# Altium schematic sheet 编码器.SchDoc
size A3; SheetNumber: 1; SheetTotal: 1
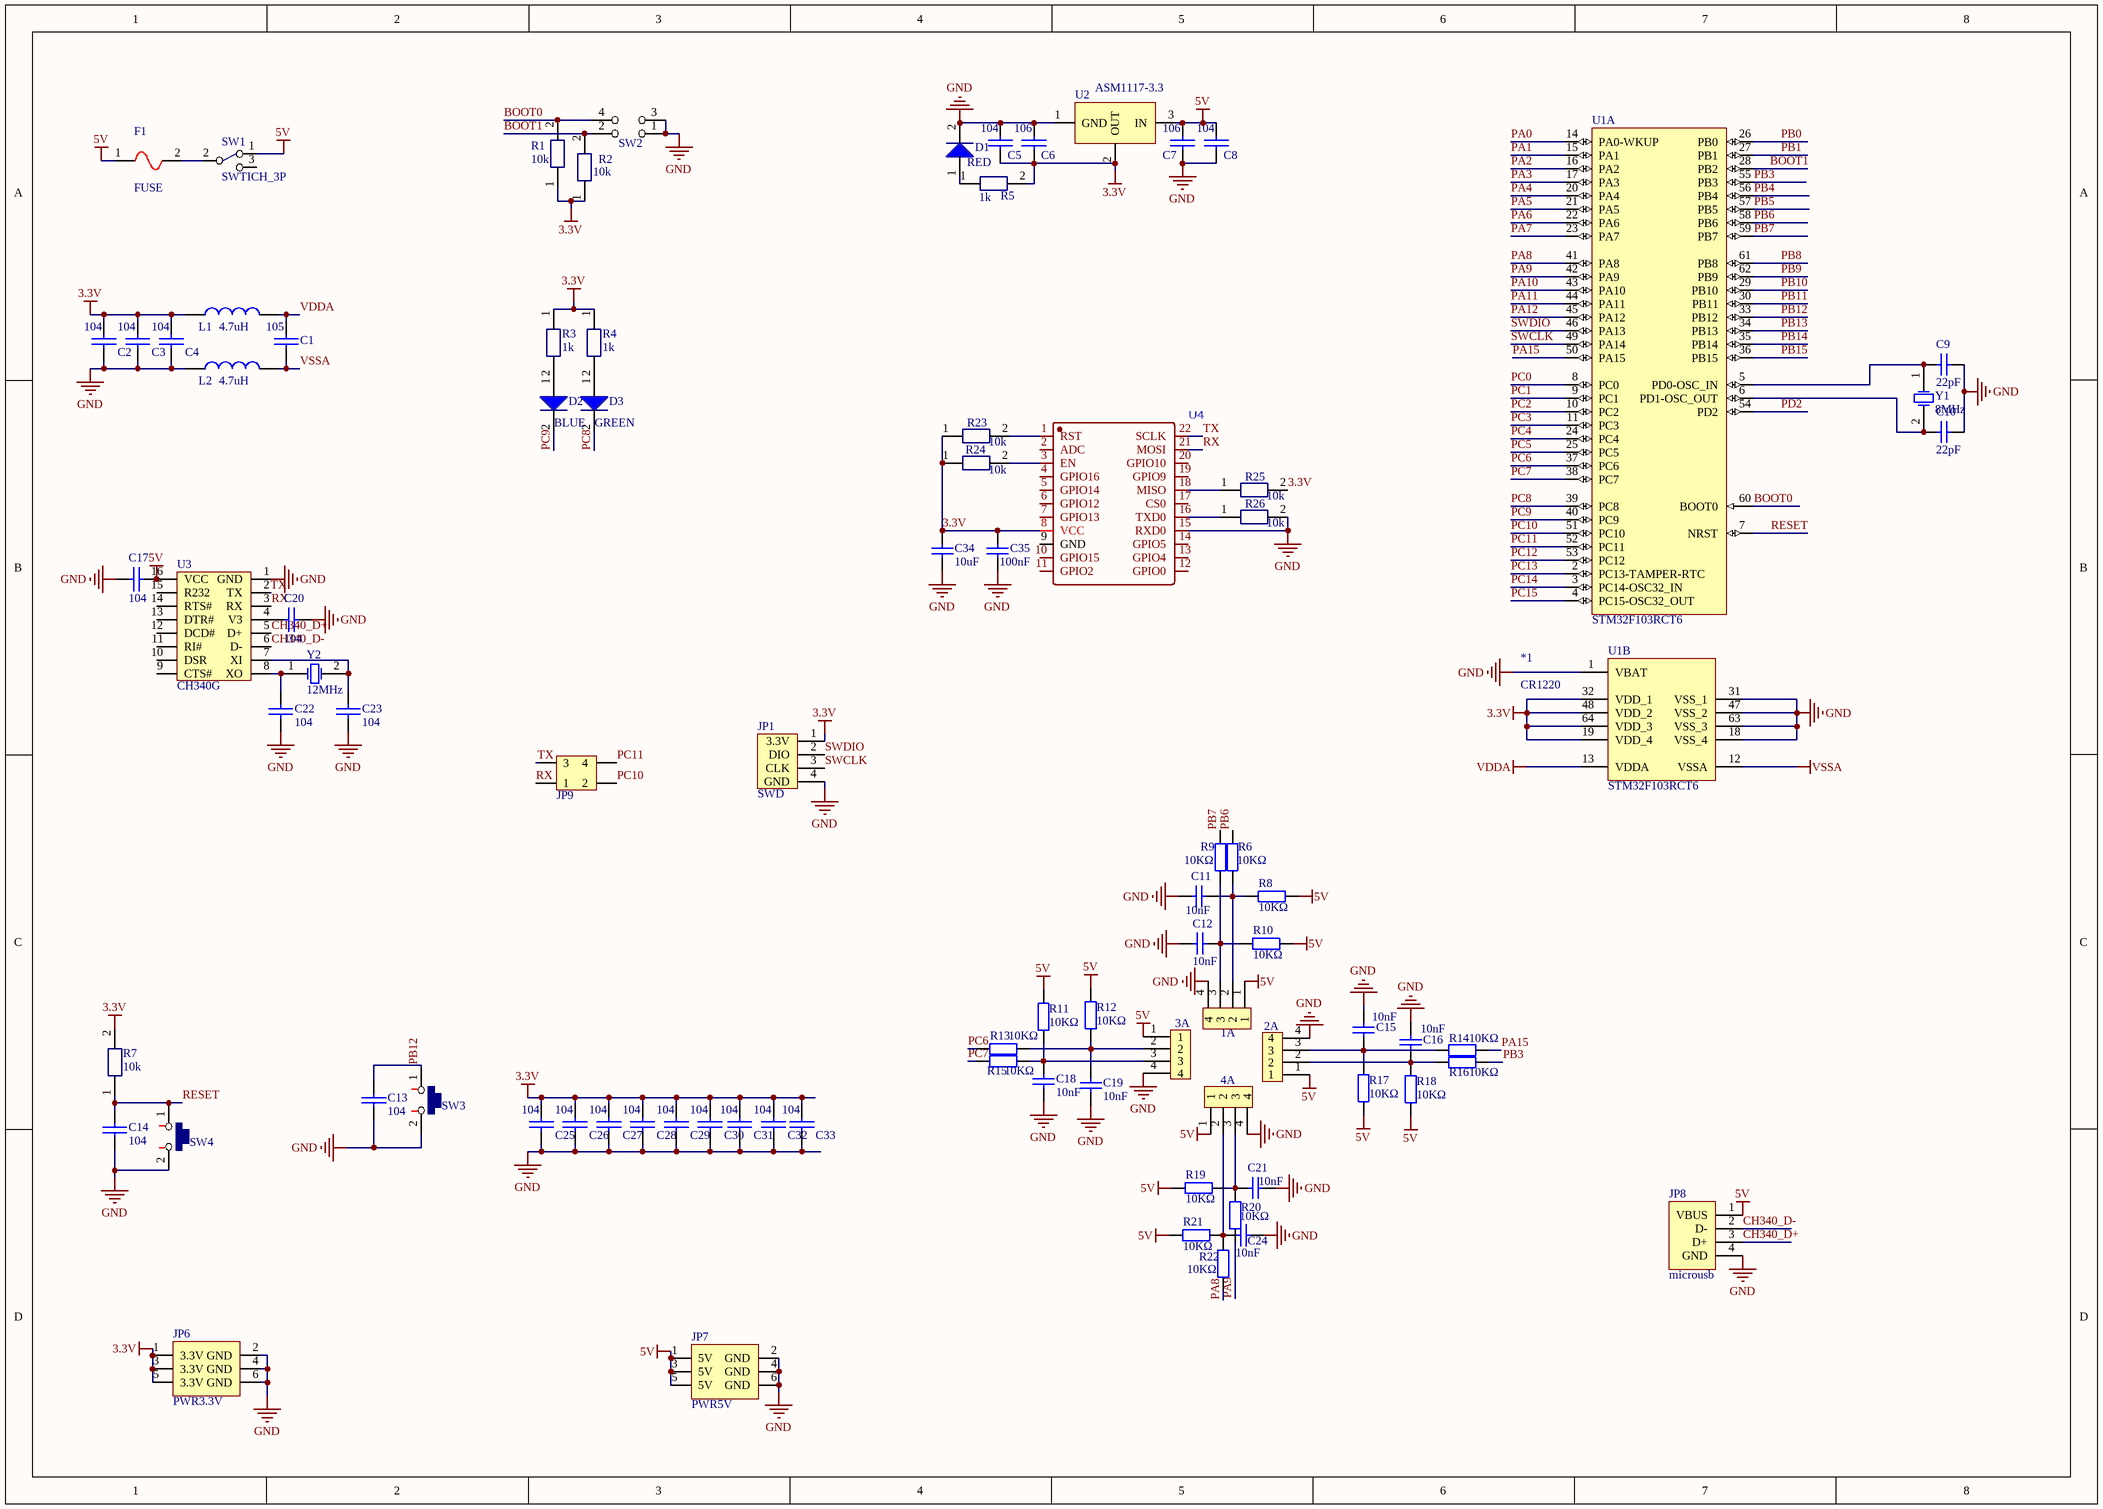
[diagram p0: 编码器.SchDoc]

## Parts
1  PIN4  (value not drawn)  (part A of 2)
2  PIN4  (value not drawn)  (part A of 2)
3  PIN4  (value not drawn)  (part A of 2)
4  PIN4  (value not drawn)  (part A of 2)
*1  CR1220
C1  0805c  [0805C]  (value not drawn)
C2  0805c  [0805C]  (value not drawn)
C3  0805c  [0805C]  (value not drawn)
C4  0805c  [0805C]  (value not drawn)
C5  0805c  [0805C]  (value not drawn)
C6  0805c  [0805C]  (value not drawn)
C7  0805c  [0805C]  (value not drawn)
C8  0805c  [0805C]  (value not drawn)
C9  22pF  [0805C]
C10  22pF  [0805C]
C11  10nF  [0805C]
C12  10nF  [0805C]
C13  0805c  [0805C]  (value not drawn)
C14  0805c  [0805C]  (value not drawn)
C15  10nF  [0805C]
C16  10nF  [0805C]
C17  0805c  [0805C]  (value not drawn)
C18  10nF  [0805C]
C19  10nF  [0805C]
C20  0805c  [0805C]  (value not drawn)
C21  10nF  [0805C]
C22  0805c  [0805C]  (value not drawn)
C23  0805c  [0805C]  (value not drawn)
C24  10nF  [0805C]
C25  0805c  [0805C]  (value not drawn)
C26  0805c  [0805C]  (value not drawn)
C27  0805c  [0805C]  (value not drawn)
C28  0805c  [0805C]  (value not drawn)
C29  0805c  [0805C]  (value not drawn)
C30  0805c  [0805C]  (value not drawn)
C31  0805c  [0805C]  (value not drawn)
C32  0805c  [0805C]  (value not drawn)
C33  0805c  [0805C]  (value not drawn)
C34  10uF  [0805C]
C35  100nF  [0805C]
D1  LED  [0805D]  (value not drawn)
D2  LED  [0805D]  (value not drawn)
D3  LED  [0805D]  (value not drawn)
F1  FUSE  [1206R]
JP1  SWD  [SWD]
JP2  PIN4  [HDR1X4]  (value not drawn)  (part B of 2)
JP3  PIN4  [HDR1X4]  (value not drawn)  (part B of 2)
JP4  PIN4  [HDR1X4]  (value not drawn)  (part B of 2)
JP5  PIN4  [HDR1X4]  (value not drawn)  (part B of 2)
JP6  PWR3.3V  [PWR]
JP7  PWR5V  [PWR]
JP8  microusb  [MICRO-USB-SMD_MICROXNJ]
JP9  2*2  [CON20VP2R54-2X2TM]  (value not drawn)
L1  0805L  [0805L]  (value not drawn)
L2  0805L  [0805L]  (value not drawn)
R1  0805r  [0805R]  (value not drawn)
R2  0805r  [0805R]  (value not drawn)
R3  0805r  [0805R]  (value not drawn)
R4  0805r  [0805R]  (value not drawn)
R5  0805r  [0805R]  (value not drawn)
R6  10KΩ  [0805R]
R7  0805r  [0805R]  (value not drawn)
R8  10KΩ  [0805R]
R9  10KΩ  [0805R]
R10  10KΩ  [0805R]
R11  10KΩ  [0805R]
R12  10KΩ  [0805R]
R13  10KΩ  [0805R]
R14  10KΩ  [0805R]
R15  10KΩ  [0805R]
R16  10KΩ  [0805R]
R17  10KΩ  [0805R]
R18  10KΩ  [0805R]
R19  10KΩ  [0805R]
R20  10KΩ  [0805R]
R21  10KΩ  [0805R]
R22  10KΩ  [0805R]
R23  0805r  [0805R]  (value not drawn)
R24  0805r  [0805R]  (value not drawn)
R25  0805r  [0805R]  (value not drawn)
R26  0805r  [0805R]  (value not drawn)
SW1  SWTICH_3P  [SWITCH_3P]
SW2  SW_BOOT  [CON20VP2R54-2X2TM]  (value not drawn)
SW3  KEY  [SW-SMD_L6.1-W3.6-LS8.0]  (value not drawn)
SW4  KEY  [SW-SMD_L6.1-W3.6-LS8.0]  (value not drawn)
U1  STM32F103RCT6  [PCBComponent_1]  (parts A,B of 2)
U2  ASM1117-3.3  [SOT223_N]
U3  CH340G  [SOP16]
U4  (no value)  [WIFIM-SMD_ESP-12F-ESP8266MOD]
Y1  8MHz  [HC-49US_L11.5-W4.5-P4.88]
Y2  12MHz  [HC-49US_L11.5-W4.5-P4.88]

## Nets
3.3V: C2.1 C3.1 C4.1 C5.2 C6.2 C25.1 C26.1 C27.1 C28.1 C29.1 C30.1 C31.1 C32.1 C33.1 C34.2 C35.2 JP1.1(3.3V) JP6.1(3.3V) JP6.3(3.3V) JP6.5(3.3V) L1.1 R1.1 R2.1 R3.1 R4.1 R5.2 R7.2 R23.1 R24.1 R25.2 U1.19(VDD_4) U1.32(VDD_1) U1.48(VDD_2) U1.64(VDD_3) U2.2(OUT) U4.8(VCC)
5V: C7.1 C8.1 C17.2 F1.1 JP2.1 JP3.1 JP4.1 JP5.1 JP7.1(5V) JP7.3(5V) JP7.5(5V) JP8.1(VBUS) R8.1 R10.1 R11.1 R12.2 R17.2 R18.1 R19.1 R21.1 SW1.1 U2.3(IN) U3.16(VCC)
GND: C2.2 C3.2 C4.2 C5.1 C6.1 C7.2 C8.2 C9.2 C10.2 C11.1 C12.1 C13.2 C14.2 C15.1 C16.2 C17.1 C18.2 C19.2 C20.2 C21.2 C22.2 C23.2 C24.2 C25.2 C26.2 C27.2 C28.2 C29.2 C30.2 C31.2 C32.2 C33.2 C34.1 C35.1 D1.2 JP1.4(GND) JP2.4 JP3.4 JP4.4 JP5.4 JP6.2(GND) JP6.4(GND) JP6.6(GND) JP7.2(GND) JP7.4(GND) JP7.6(GND) JP8.4(GND) L2.1 R26.2 SW2.1 SW2.3 SW3.2 SW4.2 U1.1(VBAT) U1.18(VSS_4) U1.31(VSS_1) U1.47(VSS_2) U1.63(VSS_3) U2.1(GND) U3.1(GND) U4.15(RXD0)
VDDA: C1.1 L1.2 U1.13(VDDA)
VSSA: C1.2 L2.2 U1.12(VSSA)
BOOT0: R1.2 SW2.4 U1.60(BOOT0)
BOOT1: R2.2 SW2.2 U1.28(PB2)
CH340_D+: JP8.3(D+) U3.5(D+)
CH340_D-: JP8.2(D-) U3.6(D-)
PA0: U1.14(PA0-WKUP)
PA1: U1.15(PA1)
PA2: U1.16(PA2)
PA3: U1.17(PA3)
PA4: U1.20(PA4)
PA5: U1.21(PA5)
PA6: U1.22(PA6)
PA7: U1.23(PA7)
PA8: R22.2 U1.41(PA8)
PA9: R20.2 U1.42(PA9)
PA10: U1.43(PA10)
PA11: U1.44(PA11)
PA12: U1.45(PA12)
PA15: R14.2 U1.50(PA15)
PB0: U1.26(PB0)
PB1: U1.27(PB1)
PB3: R16.2 U1.55(PB3)
PB4: U1.56(PB4)
PB5: U1.57(PB5)
PB6: R6.2 U1.58(PB6)
PB7: R9.2 U1.59(PB7)
PB8: U1.61(PB8)
PB9: U1.62(PB9)
PB10: U1.29(PB10)
PB11: U1.30(PB11)
PB12: C13.1 SW3.1 U1.33(PB12)
PB13: U1.34(PB13)
PB14: U1.35(PB14)
PB15: U1.36(PB15)
PC0: U1.8(PC0)
PC1: U1.9(PC1)
PC2: U1.10(PC2)
PC3: U1.11(PC3)
PC4: U1.24(PC4)
PC5: U1.25(PC5)
PC6: R13.1 U1.37(PC6)
PC7: R15.1 U1.38(PC7)
PC8: D3.2 U1.39(PC8)
PC9: D2.2 U1.40(PC9)
PC10: JP9.2 U1.51(PC10)
PC11: JP9.4 U1.52(PC11)
PC12: U1.53(PC12)
PC13: U1.2(PC13-TAMPER-RTC)
PC14: U1.3(PC14-OSC32_IN)
PC15: U1.4(PC15-OSC32_OUT)
PD2: U1.54(PD2)
RESET: C14.1 R7.1 SW4.1 U1.7(NRST)
RX: JP9.1 U3.3(RX) U4.21(MOSI)
SWCLK: JP1.3(CLK) U1.49(PA14)
SWDIO: JP1.2(DIO) U1.46(PA13)
TX: JP9.3 U3.2(TX) U4.22(SCLK)
NetC9_1: C9.1 U1.5(PD0-OSC_IN) Y1.1(OSC1)
NetC10_1: C10.1 U1.6(PD1-OSC_OUT) Y1.2(OSC2)
NetC11_2: C11.2 JP4.2 R6.1 R8.2
NetC12_2: C12.2 JP4.3 R9.1 R10.2
NetC15_2: C15.2 JP2.3 R14.1 R17.1
NetC16_1: C16.1 JP2.2 R16.1 R18.2
NetC18_1: C18.1 JP3.3 R11.2 R15.2
NetC19_1: C19.1 JP3.2 R12.1 R13.2
NetC20_1: C20.1 U3.4(V3)
NetC21_1: C21.1 JP5.3 R19.2 R20.1
NetC22_1: C22.1 U3.8(XO) Y2.1(OSC1)
NetC23_1: C23.1 U3.7(XI) Y2.2(OSC2)
NetC24_1: C24.1 JP5.2 R21.2 R22.1
NetD1_1: D1.1 R5.1
NetD2_1: D2.1 R3.2
NetD3_1: D3.1 R4.2
NetF1_2: F1.2 SW1.2
NetR23_2: R23.2 U4.1(RST)
NetR24_2: R24.2 U4.3(EN)
NetR25_1: R25.1 U4.18(MISO)
NetR26_1: R26.1 U4.16(TXD0)

Not connected (* = marked no-connect by the designer): SW1 3; U3 9(CTS#) 10(DSR) 11(RI#) 12(DCD#) 13(DTR#) 14(RTS#) 15(R232); U4 2(ADC) 4(GPIO16) 5(GPIO14) 6(GPIO12) 7(GPIO13) 9(GND) 10(GPIO15) 11(GPIO2) 12(GPIO0) 13(GPIO4) 14(GPIO5) 17(CS0) 19(GPIO9) 20(GPIO10)

## Notes on the sheet
- (in symbol 0805c) 104; 105; 106
- (in symbol 0805L) 4.7uH
- (in symbol 0805r) 10k; 1k
- (in symbol LED) RED; BLUE; GREEN

## Library data of the parts
C9 C10 = 0805 22pF (220) 5% 50V: 贴片电容; ComponentLink1Description: 供应商链接; ComponentLink1URL: http://www.szlcsc.com/product/details_2156.html; Package: 0805; Supplier: LC; SuppliersPartNumber: C1804
C11 C12 C15 C16 C18 C19 C21 C24 = 0805 10nF (103) 10% 50V: 贴片电容; ComponentLink1Description: 供应商链接; ComponentLink1URL: http://www.szlcsc.com/product/details_2062.html; Package: 0805; Supplier: LC; SuppliersPartNumber: C1710
C34 = 0805 10uF (106) 10% 25V: 贴片电容; ComponentLink1Description: 供应商链接; ComponentLink1URL: http://www.szlcsc.com/product/details_16532.html; Package: 0805; Supplier: LC; SuppliersPartNumber: C15850
C35 = 0805 100nF(104) 10% 50V: 贴片电容; ComponentLink1Description: 供应商链接; ComponentLink1URL: http://www.szlcsc.com/product/details_50686.html; Package: 0805; Supplier: LC; SuppliersPartNumber: C49678
JP8 = miniusb
R6 R8-R22 = 0805 10KΩ (1002) 1%: 贴片电阻; ComponentLink1Description: 供应商链接; ComponentLink1URL: http://www.szlcsc.com/product/details_18102.html; Package: 0805; Supplier: LC; SuppliersPartNumber: C17414
SW3 SW4 = KEY_4P
U1 = STM32F103RCT6: ARM Cortex-M3 32-bit MCU, 256 KB Flash, 48 KB Internal RAM, 51 I/Os, 64-pin LQFP, -40 to 85 degC, Tray; A/D Converter: 3x12-bit (16 Channel); D/A Converter: 2x12-bit (2 Channel); FLASH Size (Prog) (kB): 256; I/Os (High Current): 51; Internal RAM Size (kB): 48; Operating Frequency(F) (Processor speed) (MHz): 72; Supply Voltage(Vcc) min (V): 2; DatasheetVersion: Rev. 8; PackageVersion: Rev. 4, 06/2013; PackageReference: LQFP64; PackageDescription: 64-Pin Low Profile Quad Flat Package, 10 x 10 mm Body, 0.5 mm Pitch; Supplier 1: Digi-Key; Supplier Part Number 1: 497-9033-ND; Supplier 2: Newark; Supplier Part Number 2: 01P4099; Supplier 3: Newark; Supplier Part Number 3: 57P1227; Supplier 4: Mouser; Supplier Part Number 4: 511-STM32F103RCT6; Core: ARM Cortex-M3; Packing: Tray; Mounting Technology: Surface Mount; PartNumber: STM32F103RCT6; ComponentLink1Description: Manufacturer URL; ComponentLink1URL: http://www.st.com/web/en/home.html; ComponentLink2Description: Datasheet; ComponentLink2URL: http://www.st.com/st-web-ui/static/active/en/resource/technical/document/datasheet/CD00191185.pdf; ComponentLink3Description: Package Specification; ComponentLink3URL: http://www.st.com/st-web-ui/static/active/en/resource/technical/document/datasheet/DM00037051.pdf
U4 = ESP8266
Y1 Y2 = SMD-5032_2P 8MHz 20ppm 20pF: 贴片晶振; ComponentLink1Description: 供应商链接; ComponentLink1URL: http://www.szlcsc.com/product/details_117214.html; Package: SMD-5032_2P; Supplier: LC; SuppliersPartNumber: C115962